# Altium schematic sheet Sheet_LoraE32_Receive_V1.0.SchDoc
size A3
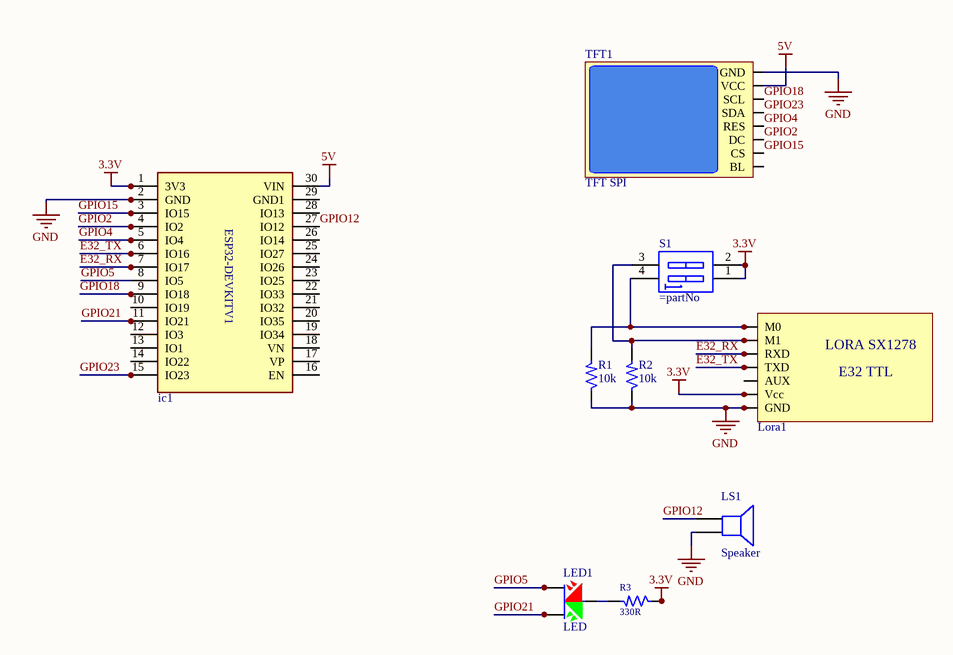
[diagram p0: Sheet_LoraE32_Receive_V1.0.SchDoc]

## Parts
ic1  ESP32 DevKit 30Pin  [ESP32 DevKit V1 30Pin CAo]  (value not drawn)
LED1  LED  [LED-52]
Lora1  LORA E32 TTL  [LORA E32 TTL CAO]  (value not drawn)
LS1  Speaker  [SPEAKER]
R1  10k  [R1/4W]
R2  10k  [R1/4W]
R3  330R  [RES-1206]
S1  (no value)  [SW-DIP2]
TFT1  TFT SPI  [TFT 1.8 SPI]

## Nets
3.3V: ic1.1(3V3) Lora1.2(Vcc) R3.1 S1.1 S1.2
5V: ic1.30(VIN) TFT1.VCC
GND: ic1.2(GND) Lora1.1(GND) LS1.2 R1.1 R2.1 TFT1.GND
E32_RX: ic1.7(IO17) Lora1.5(RXD)
E32_TX: ic1.6(IO16) Lora1.4(TXD)
GPIO2: ic1.4(IO2) TFT1.DC
GPIO4: ic1.5(IO4) TFT1.RES
GPIO5: ic1.8(IO5) LED1.1
GPIO12: ic1.27(IO12) LS1.1
GPIO15: ic1.3(IO15) TFT1.CS
GPIO18: ic1.9(IO18) TFT1.SCL
GPIO21: ic1.11(IO21) LED1.3
GPIO23: ic1.15(IO23) TFT1.SDA
NetLED1_2: LED1.2 R3.2
NetLora1_6: Lora1.6(M1) R2.2 S1.3
NetLora1_7: Lora1.7(M0) R1.2 S1.4

Not connected (* = marked no-connect by the designer): ic1 10(IO19) 12(IO3) 13(IO1) 14(IO22) 16(EN) 17(VP) 18(VN) 19(IO34) 20(IO35) 21(IO32) 22(IO33) 23(IO25) 24(IO26) 25(IO27) 26(IO14) 28(IO13) 29(GND1); Lora1 3(AUX); TFT1 BL

## Notes on the sheet
- (in symbol ESP32 DevKit 30Pin) ESP32-DEVKITV1
- (in symbol LORA E32 TTL) LORA SX1278; E32 TTL

## Library data of the parts
LED1 = LED 2A: Anot Comment Green and Red; Value: LED 3 - 5 ly 2 Colour
LS1 = Speaker: Loudspeaker; Published: 24-Mar-1999; LatestRevisionDate: 17-Jul-2002; LatestRevisionNote: Re-released for DXP Platform.; PackageReference: PIN2; Publisher: Altium Limited
R1 R2 = Res DIP: Res
R3 = Res SMD: Res
S1 = SWDIP2: WS-DITV 2.54 mm small compact THT flat actuator with top tape; Manufacturer: Wurth Elektronik; Part No.: 418127160902; ComponentLink1 Description: Manufacturer; ComponentLink2 Description: Datasheet; Pole: 02; Created Date: Dec.2015; ComponentLink1URL: http://www.we-online.com; ComponentLink2URL: http://katalog.we-online.de/em/datasheet/4181271609xx.pdf; Created by: Baojun Chen